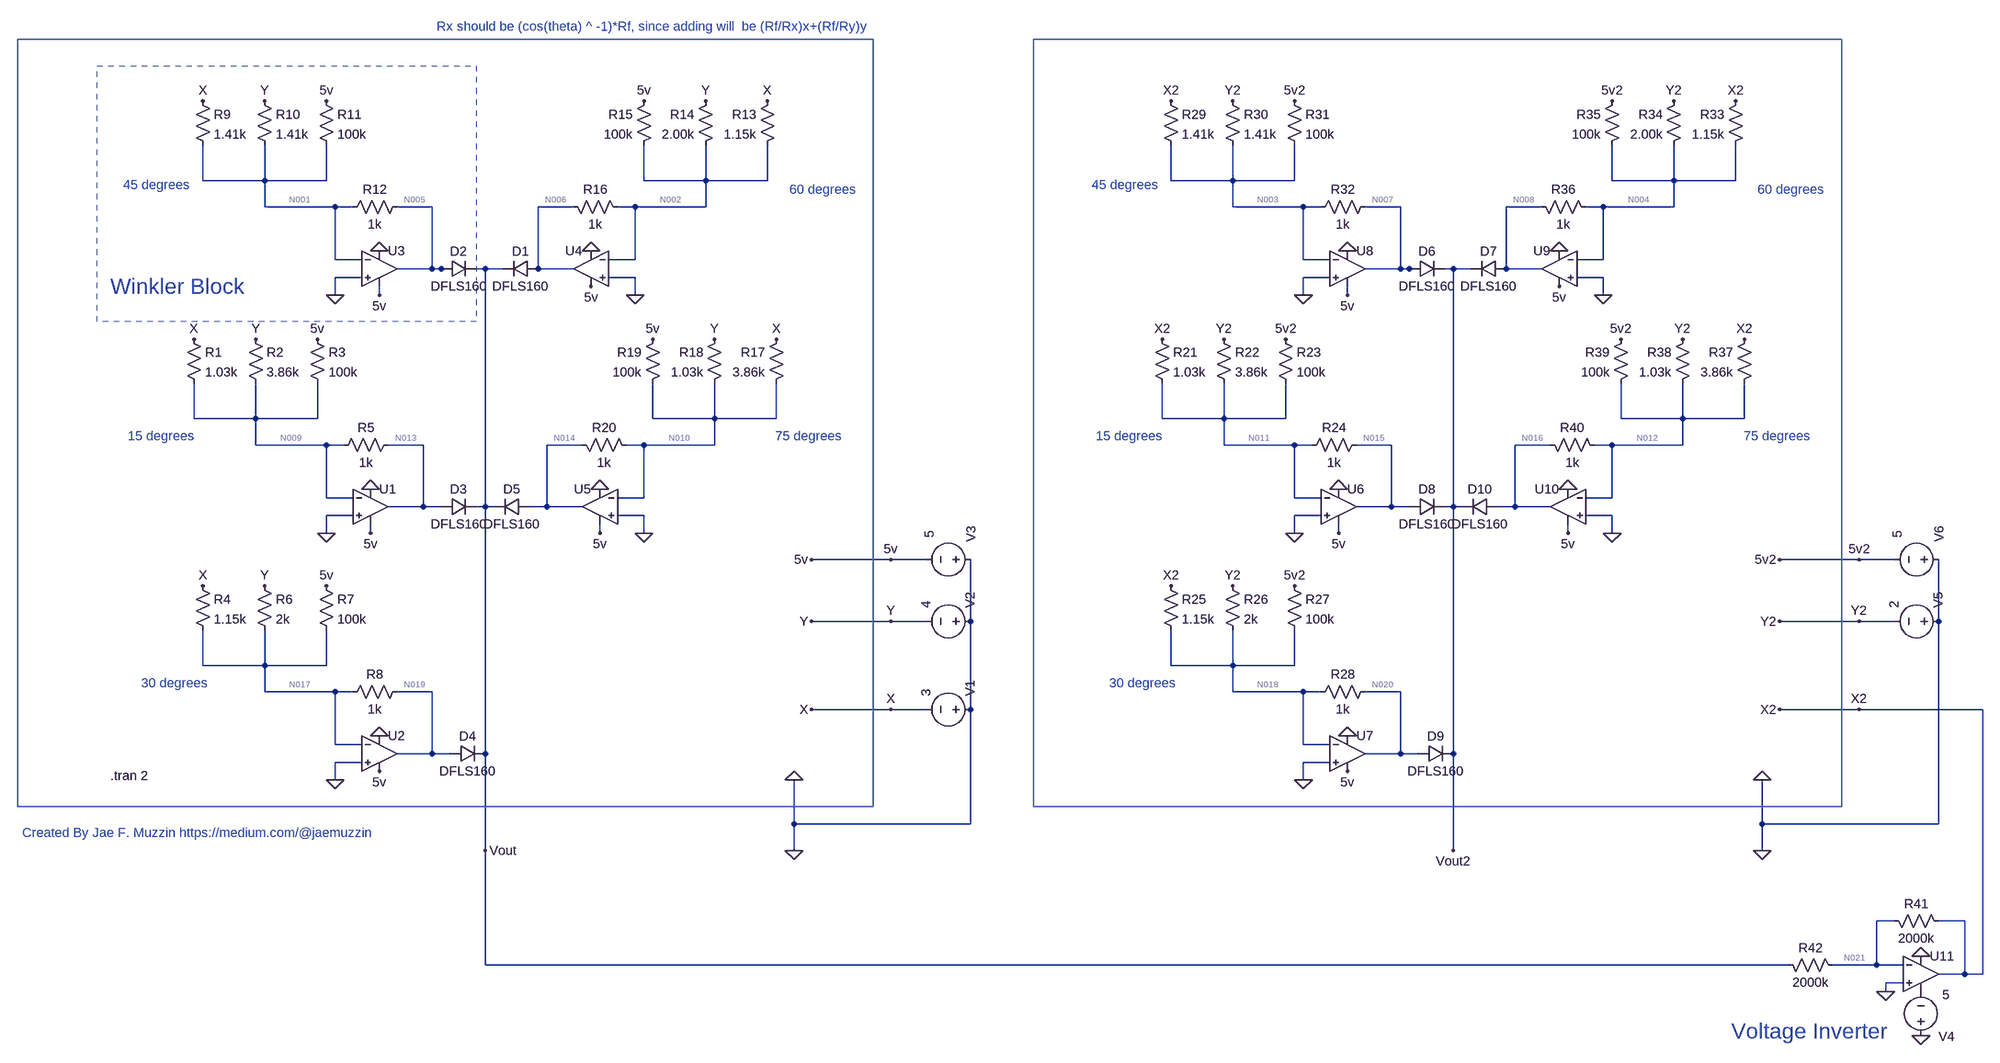
[diagram p0: schematic winkler.asc]
winkler.asc, the LTspice schematic file:
Version 4
SHEET 1 4384 1412
WIRE 64 -160 64 -224
WIRE 176 -160 176 -224
WIRE 176 -160 64 -160
WIRE 288 -160 288 -224
WIRE 288 -160 176 -160
WIRE 864 -160 864 -224
WIRE 976 -160 976 -224
WIRE 976 -160 864 -160
WIRE 1088 -160 1088 -224
WIRE 1088 -160 976 -160
WIRE 2240 -160 2240 -224
WIRE 2352 -160 2352 -224
WIRE 2352 -160 2240 -160
WIRE 2464 -160 2464 -224
WIRE 2464 -160 2352 -160
WIRE 3040 -160 3040 -224
WIRE 3152 -160 3152 -224
WIRE 3152 -160 3040 -160
WIRE 3264 -160 3264 -224
WIRE 3264 -160 3152 -160
WIRE 176 -112 176 -160
WIRE 304 -112 176 -112
WIRE 336 -112 304 -112
WIRE 480 -112 416 -112
WIRE 736 -112 672 -112
WIRE 848 -112 816 -112
WIRE 976 -112 976 -160
WIRE 976 -112 848 -112
WIRE 2352 -112 2352 -160
WIRE 2480 -112 2352 -112
WIRE 2512 -112 2480 -112
WIRE 2656 -112 2592 -112
WIRE 2912 -112 2848 -112
WIRE 3024 -112 2992 -112
WIRE 3152 -112 3152 -160
WIRE 3152 -112 3024 -112
WIRE 304 -16 304 -112
WIRE 352 -16 304 -16
WIRE 848 -16 848 -112
WIRE 848 -16 800 -16
WIRE 2480 -16 2480 -112
WIRE 2528 -16 2480 -16
WIRE 3024 -16 3024 -112
WIRE 3024 -16 2976 -16
WIRE 480 0 480 -112
WIRE 480 0 416 0
WIRE 496 0 480 0
WIRE 512 0 496 0
WIRE 576 0 560 0
WIRE 608 0 576 0
WIRE 672 0 672 -112
WIRE 736 0 672 0
WIRE 2656 0 2656 -112
WIRE 2656 0 2592 0
WIRE 2672 0 2656 0
WIRE 2688 0 2672 0
WIRE 2752 0 2736 0
WIRE 2784 0 2752 0
WIRE 2848 0 2848 -112
WIRE 2912 0 2848 0
WIRE 352 16 304 16
WIRE 848 16 800 16
WIRE 2528 16 2480 16
WIRE 3024 16 2976 16
WIRE 304 48 304 16
WIRE 384 48 384 32
WIRE 848 48 848 16
WIRE 2480 48 2480 16
WIRE 2560 48 2560 32
WIRE 3024 48 3024 16
WIRE 48 272 48 208
WIRE 160 272 160 208
WIRE 160 272 48 272
WIRE 272 272 272 208
WIRE 272 272 160 272
WIRE 880 272 880 208
WIRE 992 272 992 208
WIRE 992 272 880 272
WIRE 1104 272 1104 208
WIRE 1104 272 992 272
WIRE 2224 272 2224 208
WIRE 2336 272 2336 208
WIRE 2336 272 2224 272
WIRE 2448 272 2448 208
WIRE 2448 272 2336 272
WIRE 3056 272 3056 208
WIRE 3168 272 3168 208
WIRE 3168 272 3056 272
WIRE 3280 272 3280 208
WIRE 3280 272 3168 272
WIRE 160 320 160 272
WIRE 288 320 160 320
WIRE 320 320 288 320
WIRE 464 320 400 320
WIRE 752 320 688 320
WIRE 864 320 832 320
WIRE 992 320 992 272
WIRE 992 320 864 320
WIRE 2336 320 2336 272
WIRE 2464 320 2336 320
WIRE 2496 320 2464 320
WIRE 2640 320 2576 320
WIRE 2928 320 2864 320
WIRE 3040 320 3008 320
WIRE 3168 320 3168 272
WIRE 3168 320 3040 320
WIRE 288 416 288 320
WIRE 336 416 288 416
WIRE 864 416 864 320
WIRE 864 416 816 416
WIRE 2464 416 2464 320
WIRE 2512 416 2464 416
WIRE 3040 416 3040 320
WIRE 3040 416 2992 416
WIRE 464 432 464 320
WIRE 464 432 400 432
WIRE 496 432 464 432
WIRE 576 432 576 0
WIRE 576 432 560 432
WIRE 592 432 576 432
WIRE 688 432 688 320
WIRE 688 432 656 432
WIRE 752 432 688 432
WIRE 2640 432 2640 320
WIRE 2640 432 2576 432
WIRE 2672 432 2640 432
WIRE 2752 432 2752 0
WIRE 2752 432 2736 432
WIRE 2768 432 2752 432
WIRE 2864 432 2864 320
WIRE 2864 432 2832 432
WIRE 2928 432 2864 432
WIRE 336 448 288 448
WIRE 864 448 816 448
WIRE 2512 448 2464 448
WIRE 3040 448 2992 448
WIRE 288 480 288 448
WIRE 368 480 368 464
WIRE 784 480 784 464
WIRE 864 480 864 448
WIRE 2464 480 2464 448
WIRE 2544 480 2544 464
WIRE 2960 480 2960 464
WIRE 3040 480 3040 448
WIRE 1312 528 1168 528
WIRE 1376 528 1312 528
WIRE 3488 528 3344 528
WIRE 3552 528 3488 528
WIRE 1312 640 1168 640
WIRE 1376 640 1312 640
WIRE 1456 640 1456 528
WIRE 3488 640 3344 640
WIRE 3552 640 3488 640
WIRE 3632 640 3632 528
WIRE 64 720 64 656
WIRE 176 720 176 656
WIRE 176 720 64 720
WIRE 288 720 288 656
WIRE 288 720 176 720
WIRE 2240 720 2240 656
WIRE 2352 720 2352 656
WIRE 2352 720 2240 720
WIRE 2464 720 2464 656
WIRE 2464 720 2352 720
WIRE 176 768 176 720
WIRE 304 768 176 768
WIRE 336 768 304 768
WIRE 480 768 416 768
WIRE 2352 768 2352 720
WIRE 2480 768 2352 768
WIRE 2512 768 2480 768
WIRE 2656 768 2592 768
WIRE 1312 800 1168 800
WIRE 1376 800 1312 800
WIRE 1456 800 1456 640
WIRE 3488 800 3344 800
WIRE 3712 800 3488 800
WIRE 304 864 304 768
WIRE 352 864 304 864
WIRE 2480 864 2480 768
WIRE 2528 864 2480 864
WIRE 480 880 480 768
WIRE 480 880 416 880
WIRE 512 880 480 880
WIRE 576 880 576 432
WIRE 2656 880 2656 768
WIRE 2656 880 2592 880
WIRE 2688 880 2656 880
WIRE 2752 880 2752 432
WIRE 352 896 304 896
WIRE 2528 896 2480 896
WIRE 304 928 304 896
WIRE 2480 928 2480 896
WIRE 1136 1008 1136 928
WIRE 1456 1008 1456 800
WIRE 1456 1008 1136 1008
WIRE 3312 1008 3312 928
WIRE 3632 1008 3632 640
WIRE 3632 1008 3312 1008
WIRE 576 1056 576 880
WIRE 1136 1056 1136 1008
WIRE 2752 1056 2752 880
WIRE 3312 1056 3312 1008
WIRE 3552 1184 3520 1184
WIRE 3680 1184 3632 1184
WIRE 576 1264 576 1056
WIRE 3360 1264 576 1264
WIRE 3520 1264 3520 1184
WIRE 3520 1264 3440 1264
WIRE 3568 1264 3520 1264
WIRE 3680 1280 3680 1184
WIRE 3680 1280 3632 1280
WIRE 3712 1280 3712 800
WIRE 3712 1280 3680 1280
WIRE 3568 1296 3536 1296
WIRE 3536 1312 3536 1296
FLAG 288 480 0
FLAG 1136 1056 0
FLAG 272 128 5v
FLAG 368 480 5v
FLAG 304 928 0
FLAG 384 912 5v
FLAG 304 48 0
FLAG 384 48 5v
FLAG 288 -304 5v
FLAG 288 576 5v
FLAG 1312 800 X
FLAG 48 128 X
FLAG 64 -304 X
FLAG 64 576 X
FLAG 1312 640 Y
FLAG 160 128 Y
FLAG 176 576 Y
FLAG 176 -304 Y
FLAG 1312 528 5v
FLAG 848 48 0
FLAG 768 32 5v
FLAG 864 -304 5v
FLAG 1088 -304 X
FLAG 976 -304 Y
FLAG 384 848 0
FLAG 368 400 0
FLAG 384 -32 0
FLAG 768 -32 0
FLAG 864 480 0
FLAG 880 128 5v
FLAG 784 480 5v
FLAG 1104 128 X
FLAG 992 128 Y
FLAG 784 400 0
FLAG 576 1056 Vout
FLAG 1168 528 5v
FLAG 1168 640 Y
FLAG 1168 800 X
FLAG 1136 928 0
FLAG 2464 480 0
FLAG 3312 1056 0
FLAG 2448 128 5v2
FLAG 2544 480 5v
FLAG 2480 928 0
FLAG 2560 912 5v
FLAG 2480 48 0
FLAG 2560 48 5v
FLAG 2464 -304 5v2
FLAG 2464 576 5v2
FLAG 3488 800 X2
FLAG 2224 128 X2
FLAG 2240 -304 X2
FLAG 2240 576 X2
FLAG 3488 640 Y2
FLAG 2336 128 Y2
FLAG 2352 576 Y2
FLAG 2352 -304 Y2
FLAG 3488 528 5v2
FLAG 3024 48 0
FLAG 2944 32 5v
FLAG 3040 -304 5v2
FLAG 3264 -304 X2
FLAG 3152 -304 Y2
FLAG 2560 848 0
FLAG 2544 400 0
FLAG 2560 -32 0
FLAG 2944 -32 0
FLAG 3040 480 0
FLAG 3056 128 5v2
FLAG 2960 480 5v
FLAG 3280 128 X2
FLAG 3168 128 Y2
FLAG 2960 400 0
FLAG 2752 1056 Vout2
FLAG 3344 528 5v2
FLAG 3344 640 Y2
FLAG 3344 800 X2
FLAG 3312 928 0
FLAG 3600 1248 0
FLAG 3536 1312 0
FLAG 3600 1392 0
SYMBOL res 32 112 R0
SYMATTR InstName R1
SYMATTR Value 1.03k
SYMBOL res 144 112 R0
SYMATTR InstName R2
SYMATTR Value 3.86k
SYMBOL res 256 112 R0
SYMATTR InstName R3
SYMATTR Value 100k
SYMBOL res 416 304 R90
WINDOW 0 0 56 VBottom 2
WINDOW 3 32 56 VTop 2
SYMATTR InstName R5
SYMATTR Value 1k
SYMBOL OpAmps\\UniversalOpAmp 368 432 R0
SYMATTR InstName U1
SYMBOL res 48 560 R0
SYMATTR InstName R4
SYMATTR Value 1.15k
SYMBOL res 160 560 R0
SYMATTR InstName R6
SYMATTR Value 2k
SYMBOL res 272 560 R0
SYMATTR InstName R7
SYMATTR Value 100k
SYMBOL res 432 752 R90
WINDOW 0 0 56 VBottom 2
WINDOW 3 32 56 VTop 2
SYMATTR InstName R8
SYMATTR Value 1k
SYMBOL OpAmps\\UniversalOpAmp 384 880 R0
SYMATTR InstName U2
SYMBOL res 48 -320 R0
SYMATTR InstName R9
SYMATTR Value 1.41k
SYMBOL res 160 -320 R0
SYMATTR InstName R10
SYMATTR Value 1.41k
SYMBOL res 272 -320 R0
SYMATTR InstName R11
SYMATTR Value 100k
SYMBOL res 432 -128 R90
WINDOW 0 0 56 VBottom 2
WINDOW 3 32 56 VTop 2
SYMATTR InstName R12
SYMATTR Value 1k
SYMBOL OpAmps\\UniversalOpAmp 384 0 R0
SYMATTR InstName U3
SYMBOL res 1104 -320 M0
SYMATTR InstName R13
SYMATTR Value 1.15k
SYMBOL res 992 -320 M0
SYMATTR InstName R14
SYMATTR Value 2.00k
SYMBOL res 880 -320 M0
SYMATTR InstName R15
SYMATTR Value 100k
SYMBOL res 720 -128 M90
WINDOW 0 0 56 VBottom 2
WINDOW 3 32 56 VTop 2
SYMATTR InstName R16
SYMATTR Value 1k
SYMBOL OpAmps\\UniversalOpAmp 768 0 M0
SYMATTR InstName U4
SYMBOL diode 496 16 R270
WINDOW 0 32 32 VTop 2
WINDOW 3 0 32 VBottom 2
SYMATTR InstName D2
SYMATTR Value DFLS160
SYMBOL voltage 1472 800 M270
WINDOW 123 0 0 Left 0
WINDOW 39 0 0 Left 0
SYMATTR InstName V1
SYMATTR Value 3
SYMBOL voltage 1472 640 M270
WINDOW 123 0 0 Left 0
WINDOW 39 0 0 Left 0
SYMATTR InstName V2
SYMATTR Value 4
SYMBOL voltage 1472 528 M270
WINDOW 0 32 14 Left 2
WINDOW 123 0 0 Left 0
WINDOW 39 0 0 Left 0
WINDOW 3 39 90 Left 2
SYMATTR InstName V3
SYMATTR Value 5
SYMBOL diode 672 16 M270
WINDOW 0 32 32 VTop 2
WINDOW 3 0 32 VBottom 2
SYMATTR InstName D1
SYMATTR Value DFLS160
SYMBOL diode 496 448 R270
WINDOW 0 32 32 VTop 2
WINDOW 3 0 32 VBottom 2
SYMATTR InstName D3
SYMATTR Value DFLS160
SYMBOL diode 512 896 R270
WINDOW 0 32 32 VTop 2
WINDOW 3 0 32 VBottom 2
SYMATTR InstName D4
SYMATTR Value DFLS160
SYMBOL res 1120 112 M0
SYMATTR InstName R17
SYMATTR Value 3.86k
SYMBOL res 1008 112 M0
SYMATTR InstName R18
SYMATTR Value 1.03k
SYMBOL res 896 112 M0
SYMATTR InstName R19
SYMATTR Value 100k
SYMBOL res 736 304 M90
WINDOW 0 0 56 VBottom 2
WINDOW 3 32 56 VTop 2
SYMATTR InstName R20
SYMATTR Value 1k
SYMBOL OpAmps\\UniversalOpAmp 784 432 M0
SYMATTR InstName U5
SYMBOL diode 656 448 M270
WINDOW 0 32 32 VTop 2
WINDOW 3 0 32 VBottom 2
SYMATTR InstName D5
SYMATTR Value DFLS160
SYMBOL res 2208 112 R0
SYMATTR InstName R21
SYMATTR Value 1.03k
SYMBOL res 2320 112 R0
SYMATTR InstName R22
SYMATTR Value 3.86k
SYMBOL res 2432 112 R0
SYMATTR InstName R23
SYMATTR Value 100k
SYMBOL res 2592 304 R90
WINDOW 0 0 56 VBottom 2
WINDOW 3 32 56 VTop 2
SYMATTR InstName R24
SYMATTR Value 1k
SYMBOL OpAmps\\UniversalOpAmp 2544 432 R0
SYMATTR InstName U6
SYMBOL res 2224 560 R0
SYMATTR InstName R25
SYMATTR Value 1.15k
SYMBOL res 2336 560 R0
SYMATTR InstName R26
SYMATTR Value 2k
SYMBOL res 2448 560 R0
SYMATTR InstName R27
SYMATTR Value 100k
SYMBOL res 2608 752 R90
WINDOW 0 0 56 VBottom 2
WINDOW 3 32 56 VTop 2
SYMATTR InstName R28
SYMATTR Value 1k
SYMBOL OpAmps\\UniversalOpAmp 2560 880 R0
SYMATTR InstName U7
SYMBOL res 2224 -320 R0
SYMATTR InstName R29
SYMATTR Value 1.41k
SYMBOL res 2336 -320 R0
SYMATTR InstName R30
SYMATTR Value 1.41k
SYMBOL res 2448 -320 R0
SYMATTR InstName R31
SYMATTR Value 100k
SYMBOL res 2608 -128 R90
WINDOW 0 0 56 VBottom 2
WINDOW 3 32 56 VTop 2
SYMATTR InstName R32
SYMATTR Value 1k
SYMBOL OpAmps\\UniversalOpAmp 2560 0 R0
SYMATTR InstName U8
SYMBOL res 3280 -320 M0
SYMATTR InstName R33
SYMATTR Value 1.15k
SYMBOL res 3168 -320 M0
SYMATTR InstName R34
SYMATTR Value 2.00k
SYMBOL res 3056 -320 M0
SYMATTR InstName R35
SYMATTR Value 100k
SYMBOL res 2896 -128 M90
WINDOW 0 0 56 VBottom 2
WINDOW 3 32 56 VTop 2
SYMATTR InstName R36
SYMATTR Value 1k
SYMBOL OpAmps\\UniversalOpAmp 2944 0 M0
SYMATTR InstName U9
SYMBOL diode 2672 16 R270
WINDOW 0 32 32 VTop 2
WINDOW 3 0 32 VBottom 2
SYMATTR InstName D6
SYMATTR Value DFLS160
SYMBOL voltage 3648 640 M270
WINDOW 123 0 0 Left 0
WINDOW 39 0 0 Left 0
SYMATTR InstName V5
SYMATTR Value 2
SYMBOL voltage 3648 528 M270
WINDOW 0 32 14 Left 2
WINDOW 123 0 0 Left 0
WINDOW 39 0 0 Left 0
WINDOW 3 39 90 Left 2
SYMATTR InstName V6
SYMATTR Value 5
SYMBOL diode 2848 16 M270
WINDOW 0 32 32 VTop 2
WINDOW 3 0 32 VBottom 2
SYMATTR InstName D7
SYMATTR Value DFLS160
SYMBOL diode 2672 448 R270
WINDOW 0 32 32 VTop 2
WINDOW 3 0 32 VBottom 2
SYMATTR InstName D8
SYMATTR Value DFLS160
SYMBOL diode 2688 896 R270
WINDOW 0 32 32 VTop 2
WINDOW 3 0 32 VBottom 2
SYMATTR InstName D9
SYMATTR Value DFLS160
SYMBOL res 3296 112 M0
SYMATTR InstName R37
SYMATTR Value 3.86k
SYMBOL res 3184 112 M0
SYMATTR InstName R38
SYMATTR Value 1.03k
SYMBOL res 3072 112 M0
SYMATTR InstName R39
SYMATTR Value 100k
SYMBOL res 2912 304 M90
WINDOW 0 0 56 VBottom 2
WINDOW 3 32 56 VTop 2
SYMATTR InstName R40
SYMATTR Value 1k
SYMBOL OpAmps\\UniversalOpAmp 2960 432 M0
SYMATTR InstName U10
SYMBOL diode 2832 448 M270
WINDOW 0 32 32 VTop 2
WINDOW 3 0 32 VBottom 2
SYMATTR InstName D10
SYMATTR Value DFLS160
SYMBOL OpAmps\\UniversalOpAmp 3600 1280 R0
SYMATTR InstName U11
SYMBOL res 3536 1168 M90
WINDOW 0 0 56 VBottom 2
WINDOW 3 32 56 VTop 2
SYMATTR InstName R41
SYMATTR Value 2000k
SYMBOL voltage 3600 1408 M180
WINDOW 0 32 14 Left 2
WINDOW 123 0 0 Left 0
WINDOW 39 0 0 Left 0
WINDOW 3 39 90 Left 2
SYMATTR InstName V4
SYMATTR Value 5
SYMBOL res 3344 1248 M90
WINDOW 0 0 56 VBottom 2
WINDOW 3 32 56 VTop 2
SYMATTR InstName R42
SYMATTR Value 2000k
TEXT -104 920 Left 2 !.tran 2
TEXT -80 -152 Left 2 ;45 degrees
TEXT -72 304 Left 2 ;15 degrees
TEXT -48 752 Left 2 ;30 degrees
TEXT 1128 -144 Left 2 ;60 degrees
TEXT 488 -440 Left 2 ;Rx should be (cos(theta) ^ -1)*Rf, since adding will  be (Rf/Rx)x+(Rf/Ry)y
TEXT 1224 304 Right 2 ;75 degrees
TEXT 2096 -152 Left 2 ;45 degrees
TEXT 2104 304 Left 2 ;15 degrees
TEXT 2128 752 Left 2 ;30 degrees
TEXT 3304 -144 Left 2 ;60 degrees
TEXT 3400 304 Right 2 ;75 degrees
TEXT -104 32 Left 4 ;Winkler Block
TEXT 3256 1384 Left 4 ;Voltage Inverter
TEXT -264 1024 Left 2 ;Created By Jae F. Muzzin https://medium.com/@jaemuzzin
RECTANGLE Normal 560 96 -128 -368 1
RECTANGLE Normal 1280 976 -272 -416
RECTANGLE Normal 3456 976 1904 -416

The netlist it stands for:
* winkler.asc
R1 X N009 1.03k
R2 Y N009 3.86k
R3 5v N009 100k
R5 N013 N009 1k
XU1 0 N009 0 5v N013 level1 Avol=1Meg GBW=10Meg Vos=0 En=0 Enk=0 In=0 Ink=0 Rin=500Meg  ; pins In+ In- V+ V- OUT
R4 X N017 1.15k
R6 Y N017 2k
R7 5v N017 100k
R8 N019 N017 1k
XU2 0 N017 0 5v N019 level1 Avol=1Meg GBW=10Meg Vos=0 En=0 Enk=0 In=0 Ink=0 Rin=500Meg  ; pins In+ In- V+ V- OUT
R9 X N001 1.41k
R10 Y N001 1.41k
R11 5v N001 100k
R12 N005 N001 1k
XU3 0 N001 0 5v N005 level1 Avol=1Meg GBW=10Meg Vos=0 En=0 Enk=0 In=0 Ink=0 Rin=500Meg  ; pins In+ In- V+ V- OUT
R13 X N002 1.15k
R14 Y N002 2.00k
R15 5v N002 100k
R16 N006 N002 1k
XU4 0 N002 0 5v N006 level1 Avol=1Meg GBW=10Meg Vos=0 En=0 Enk=0 In=0 Ink=0 Rin=500Meg  ; pins In+ In- V+ V- OUT
D2 N005 Vout DFLS160
V1 0 X 3
V2 0 Y 4
V3 0 5v 5
D1 N006 Vout DFLS160
D3 N013 Vout DFLS160
D4 N019 Vout DFLS160
R17 X N010 3.86k
R18 Y N010 1.03k
R19 5v N010 100k
R20 N014 N010 1k
XU5 0 N010 0 5v N014 level1 Avol=1Meg GBW=10Meg Vos=0 En=0 Enk=0 In=0 Ink=0 Rin=500Meg  ; pins In+ In- V+ V- OUT
D5 N014 Vout DFLS160
R21 X2 N011 1.03k
R22 Y2 N011 3.86k
R23 5v2 N011 100k
R24 N015 N011 1k
XU6 0 N011 0 5v N015 level1 Avol=1Meg GBW=10Meg Vos=0 En=0 Enk=0 In=0 Ink=0 Rin=500Meg  ; pins In+ In- V+ V- OUT
R25 X2 N018 1.15k
R26 Y2 N018 2k
R27 5v2 N018 100k
R28 N020 N018 1k
XU7 0 N018 0 5v N020 level1 Avol=1Meg GBW=10Meg Vos=0 En=0 Enk=0 In=0 Ink=0 Rin=500Meg  ; pins In+ In- V+ V- OUT
R29 X2 N003 1.41k
R30 Y2 N003 1.41k
R31 5v2 N003 100k
R32 N007 N003 1k
XU8 0 N003 0 5v N007 level1 Avol=1Meg GBW=10Meg Vos=0 En=0 Enk=0 In=0 Ink=0 Rin=500Meg  ; pins In+ In- V+ V- OUT
R33 X2 N004 1.15k
R34 Y2 N004 2.00k
R35 5v2 N004 100k
R36 N008 N004 1k
XU9 0 N004 0 5v N008 level1 Avol=1Meg GBW=10Meg Vos=0 En=0 Enk=0 In=0 Ink=0 Rin=500Meg  ; pins In+ In- V+ V- OUT
D6 N007 Vout2 DFLS160
V5 0 Y2 2
V6 0 5v2 5
D7 N008 Vout2 DFLS160
D8 N015 Vout2 DFLS160
D9 N020 Vout2 DFLS160
R37 X2 N012 3.86k
R38 Y2 N012 1.03k
R39 5v2 N012 100k
R40 N016 N012 1k
XU10 0 N012 0 5v N016 level1 Avol=1Meg GBW=10Meg Vos=0 En=0 Enk=0 In=0 Ink=0 Rin=500Meg  ; pins In+ In- V+ V- OUT
D10 N016 Vout2 DFLS160
XU11 0 N021 0 P001 X2 level1 Avol=1Meg GBW=10Meg Vos=0 En=0 Enk=0 In=0 Ink=0 Rin=500Meg  ; pins In+ In- V+ V- OUT
R41 N021 X2 2000k
V4 0 P001 5
R42 Vout N021 2000k
.model D D
.lib standard.dio
.tran 2
* 45 degrees
* 15 degrees
* 30 degrees
* 60 degrees
* Rx should be (cos(theta) ^ -1)*Rf, since adding will  be (Rf/Rx)x+(Rf/Ry)y
* 75 degrees
* 45 degrees
* 15 degrees
* 30 degrees
* 60 degrees
* 75 degrees
* Winkler Block
* Voltage Inverter
* Created By Jae F. Muzzin https://medium.com/@jaemuzzin
.lib UniversalOpAmp1.lib
.backanno
.end

* Results of the author's LTspice run, read from the files saved beside the schematic
* Operating Point, zero values left out:
*   V(x) = -3 V
*   V(n009) = -3.999 µV
*   V(y) = -4 V
*   V(5v) = -5 V
*   V(n013) = 3.999 V
*   V(n017) = -4.659 µV
*   V(n019) = 4.659 V
*   V(n001) = -5.015 µV
*   V(n005) = 5.015 V
*   V(n002) = -4.659 µV
*   V(n006) = 4.659 V
*   V(vout) = 4.959 V
*   V(n010) = -4.711 µV
*   V(n014) = 4.711 V
*   V(x2) = -4.949 V
*   V(n011) = -5.374 µV
*   V(y2) = -2 V
*   V(5v2) = -5 V
*   V(n015) = 5.373 V
*   V(n018) = -5.354 µV
*   V(n020) = 5.353 V
*   V(n003) = -4.979 µV
*   V(n007) = 4.978 V
*   V(n004) = -5.354 µV
*   V(n008) = 5.353 V
*   V(vout2) = 5.348 V
*   V(n012) = -3.274 µV
*   V(n016) = 3.274 V
*   V(n021) = 4.951 µV
*   V(p001) = -5 V
*   I(D2) = 5.423 µA
*   I(D1) = -736 nA
*   I(D3) = -736 nA
*   I(D4) = -736 nA
*   I(D5) = -735.9 nA
*   I(D6) = -736 nA
*   I(D7) = 159.2 nA
*   I(D8) = 1.154 µA
*   I(D9) = 159.2 nA
*   I(D10) = -736 nA
*   I(R1) = -2.913 mA
*   I(R2) = -1.036 mA
*   I(R3) = -50 µA
*   I(R5) = 3.999 mA
*   I(R4) = -2.609 mA
*   I(R6) = -2 mA
*   I(R7) = -50 µA
*   I(R8) = 4.659 mA
*   I(R9) = -2.128 mA
*   I(R10) = -2.837 mA
*   I(R11) = -50 µA
*   I(R12) = 5.015 mA
*   I(R13) = -2.609 mA
*   I(R14) = -2 mA
*   I(R15) = -50 µA
*   I(R16) = 4.659 mA
*   I(R17) = -777.2 µA
*   I(R18) = -3.883 mA
*   I(R19) = -50 µA
*   I(R20) = 4.711 mA
*   I(R21) = -4.805 mA
*   I(R22) = -518.1 µA
*   I(R23) = -50 µA
*   I(R24) = 5.373 mA
*   I(R25) = -4.303 mA
*   I(R26) = -1 mA
*   I(R27) = -50 µA
*   I(R28) = 5.353 mA
*   I(R29) = -3.51 mA
*   I(R30) = -1.418 mA
*   I(R31) = -50 µA
*   I(R32) = 4.978 mA
*   I(R33) = -4.303 mA
*   I(R34) = -1 mA
*   I(R35) = -50 µA
*   I(R36) = 5.353 mA
*   I(R37) = -1.282 mA
*   I(R38) = -1.942 mA
*   I(R39) = -50 µA
*   I(R40) = 3.274 mA
*   I(R41) = 2.475 µA
*   I(R42) = 2.48 µA
*   I(V1) = -11.03 mA
*   I(V2) = -11.76 mA
*   I(V3) = -250.1 µA
*   I(V5) = -5.878 mA
*   I(V6) = -250 µA
*   I(V4) = -10 nA